# Altium schematic sheet Main_Power.SchDoc
size A1; Organization: Protel International P/L; Address1: L3, 12a Rodborough Rd; Address2: Frenchs Forest; Address3: NSW; Address4: Australia 2086
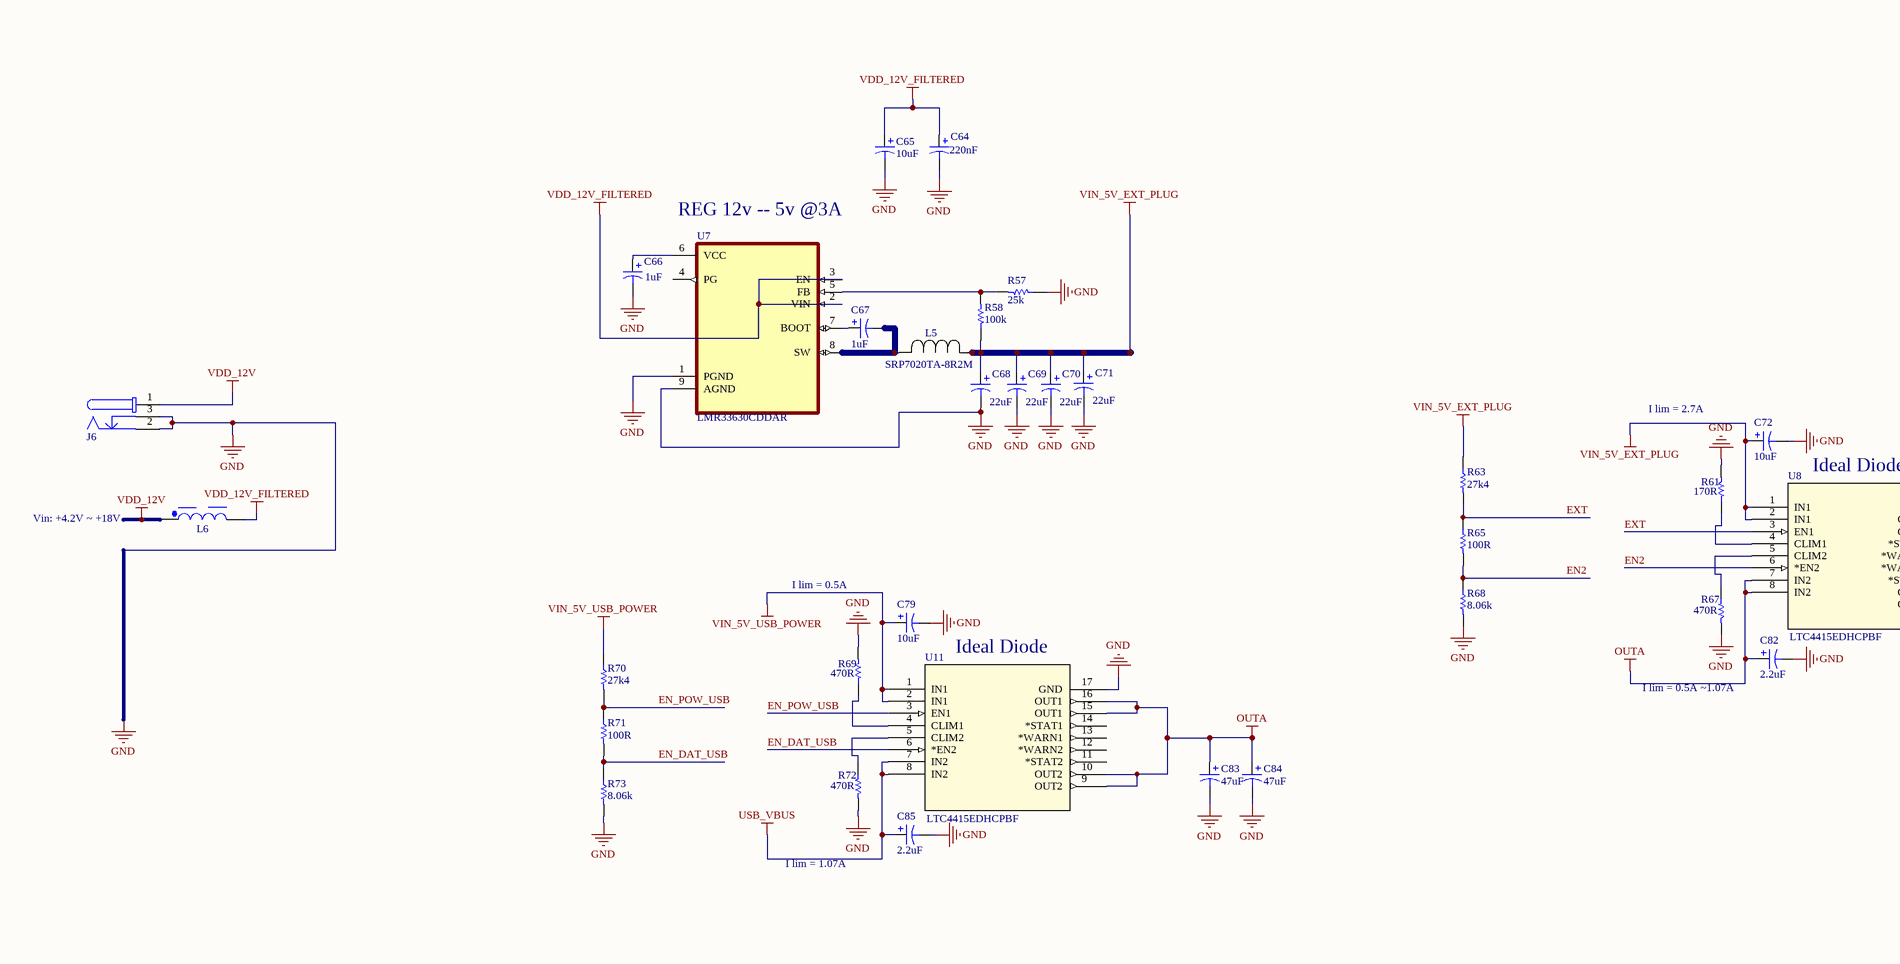
[diagram p0: Main_Power.SchDoc, top left]
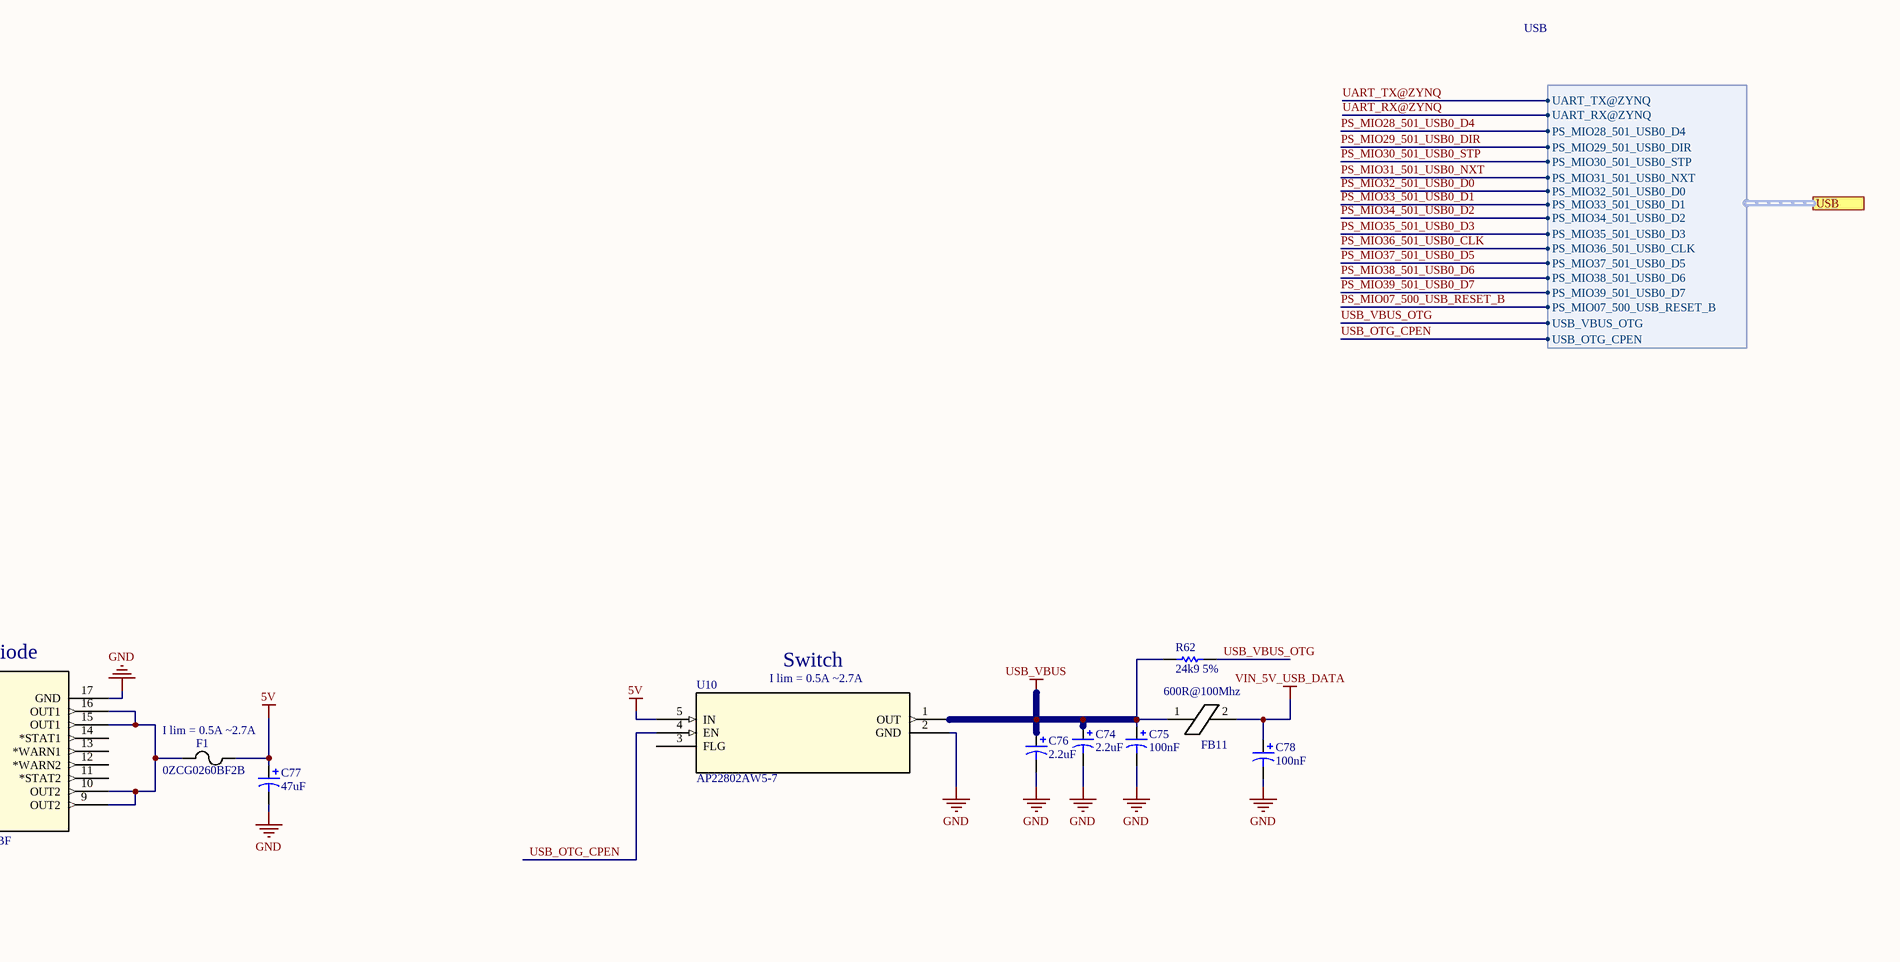
[diagram p1: Main_Power.SchDoc, top right]
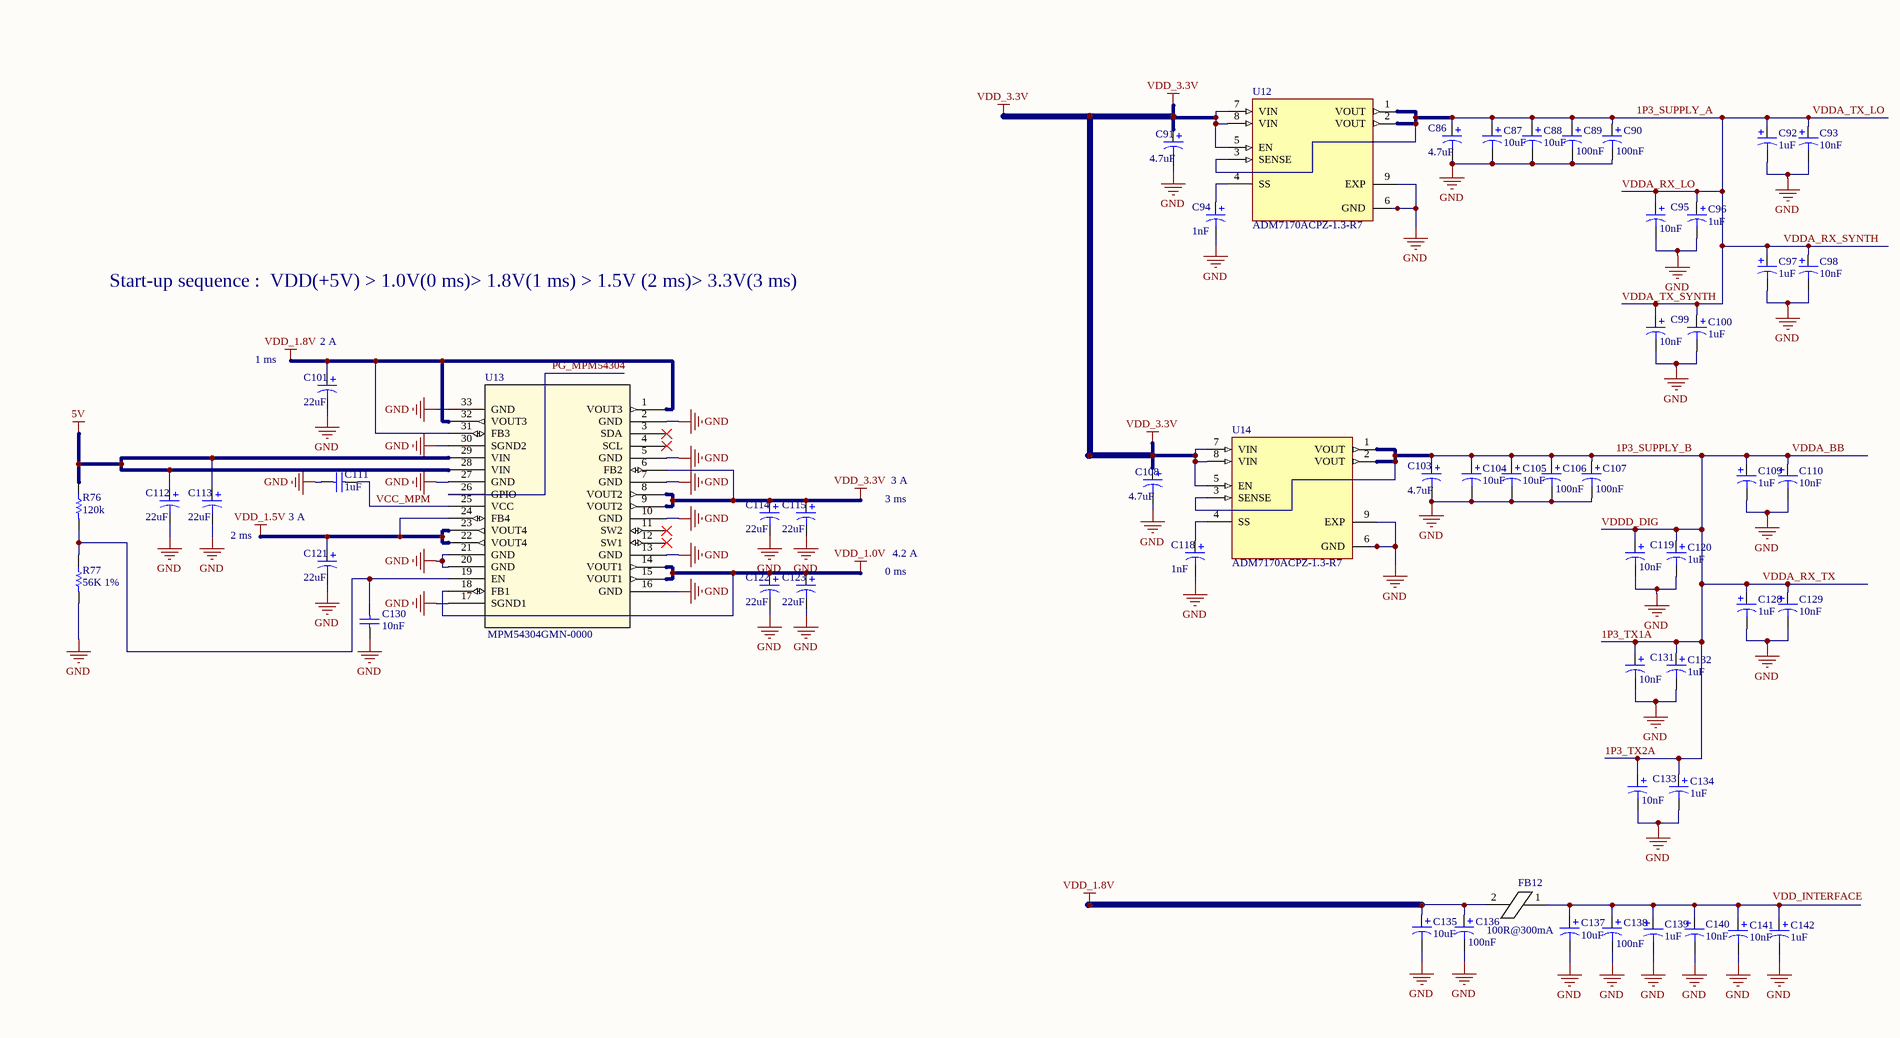
[diagram p2: Main_Power.SchDoc, bottom left]
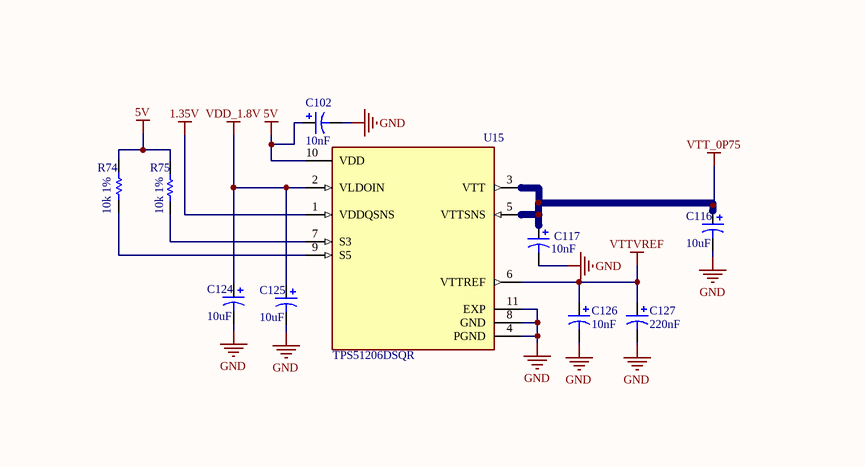
[diagram p3: Main_Power.SchDoc, bottom right]

## Parts
C64  value 220nF  [C0805]  (hidden comment: Pol3)
C65  value 10uF  [C0805]  (hidden comment: Cap Pol3)
C66  value 1uF  [C0805]  (hidden comment: Pol3)
C67  value 1uF  [C0805]  (hidden comment: Pol3)
C68  value 22uF  [C0805]  (hidden comment: Pol3)
C69  value 22uF  [C0805]  (hidden comment: Pol3)
C70  value 22uF  [C0805]  (hidden comment: Pol3)
C71  value 22uF  [C0805]  (hidden comment: Pol3)
C72  value 10uF  [C0805]  (hidden comment: Cap Pol3)
C74  value 2.2uF  [C0805]  (hidden comment: Cap Pol3)
C75  value 100nF  [C0805]  (hidden comment: Cap Pol3)
C76  value 2.2uF  [C0805]  (hidden comment: Cap Pol3)
C77  value 47uF  [C0805]  (hidden comment: Cap Pol3)
C78  value 100nF  [C0805]  (hidden comment: Cap Pol3)
C79  value 10uF  [C0805]  (hidden comment: Cap Pol3)
C82  value 2.2uF  [C0805]  (hidden comment: Cap Pol3)
C83  value 47uF  [C0805]  (hidden comment: Cap Pol3)
C84  value 47uF  [C0805]  (hidden comment: Cap Pol3)
C85  value 2.2uF  [C0805]  (hidden comment: Cap Pol3)
C86  value 4.7uF  [C0805]  (hidden comment: Pol3)
C87  value 10uF  [C0805]  (hidden comment: Cap Pol3)
C88  value 10uF  [C0805]  (hidden comment: Cap Pol3)
C89  value 100nF  [C0805]  (hidden comment: Cap Pol3)
C90  value 100nF  [C0805]  (hidden comment: Cap Pol3)
C91  value 4.7uF  [C0805]  (hidden comment: Pol3)
C92  value 1uF  [C0805]  (hidden comment: Cap Pol3)
C93  value 10nF  [C0805]  (hidden comment: Cap Pol3)
C94  value 1nF  [C0805]  (hidden comment: Pol3)
C95  value 10nF  [C0805]  (hidden comment: Cap Pol3)
C96  value 1uF  [C0805]  (hidden comment: Cap Pol3)
C97  value 1uF  [C0805]  (hidden comment: Cap Pol3)
C98  value 10nF  [C0805]  (hidden comment: Cap Pol3)
C99  value 10nF  [C0805]  (hidden comment: Cap Pol3)
C100  value 1uF  [C0805]  (hidden comment: Cap Pol3)
C101  value 22uF  [C0805]  (hidden comment: Pol3)
C102  value 10nF  [C0805]  (hidden comment: Cap Pol3)
C103  value 4.7uF  [C0805]  (hidden comment: Pol3)
C104  value 10uF  [C0805]  (hidden comment: Cap Pol3)
C105  value 10uF  [C0805]  (hidden comment: Cap Pol3)
C106  value 100nF  [C0805]  (hidden comment: Cap Pol3)
C107  value 100nF  [C0805]  (hidden comment: Cap Pol3)
C108  value 4.7uF  [C0805]  (hidden comment: Pol3)
C109  value 1uF  [C0805]  (hidden comment: Cap Pol3)
C110  value 10nF  [C0805]  (hidden comment: Cap Pol3)
C111  value 1uF  [1608[0603]]
C112  value 22uF  [C0805]  (hidden comment: Pol3)
C113  value 22uF  [C0805]  (hidden comment: Pol3)
C114  value 22uF  [C0805]  (hidden comment: Pol3)
C115  value 22uF  [C0805]  (hidden comment: Pol3)
C116  value 10uF  [C0805]  (hidden comment: Pol3)
C117  value 10nF  [C0805]  (hidden comment: Cap Pol3)
C118  value 1nF  [C0805]  (hidden comment: Pol3)
C119  value 10nF  [C0805]  (hidden comment: Cap Pol3)
C120  value 1uF  [C0805]  (hidden comment: Cap Pol3)
C121  value 22uF  [C0805]  (hidden comment: Pol3)
C122  value 22uF  [C0805]  (hidden comment: Pol3)
C123  value 22uF  [C0805]  (hidden comment: Pol3)
C124  value 10uF  [C0805]  (hidden comment: Pol3)
C125  value 10uF  [C0805]  (hidden comment: Pol3)
C126  value 10nF  [C0805]  (hidden comment: Cap Pol3)
C127  value 220nF  [C0805]  (hidden comment: Cap Pol3)
C128  value 1uF  [C0805]  (hidden comment: Cap Pol3)
C129  value 10nF  [C0805]  (hidden comment: Cap Pol3)
C130  value 10nF  [1608[0603]]
C131  value 10nF  [C0805]  (hidden comment: Cap Pol3)
C132  value 1uF  [C0805]  (hidden comment: Cap Pol3)
C133  value 10nF  [C0805]  (hidden comment: Cap Pol3)
C134  value 1uF  [C0805]  (hidden comment: Cap Pol3)
C135  value 10uF  [C0805]  (hidden comment: Cap Pol3)
C136  value 100nF  [C0805]  (hidden comment: Cap Pol3)
C137  value 10uF  [C0805]  (hidden comment: Cap Pol3)
C138  value 100nF  [C0805]  (hidden comment: Cap Pol3)
C139  value 1uF  [C0805]  (hidden comment: Cap Pol3)
C140  value 10nF  [C0805]  (hidden comment: Cap Pol3)
C141  value 10nF  [C0805]  (hidden comment: Cap Pol3)
C142  value 1uF  [C0805]  (hidden comment: Cap Pol3)
F1  0ZCG0260BF2B  [0ZCG_BEL]
FB11  FERRITA  [0805R]  (value not drawn)
FB12  FERRITA  [0805R]  (value not drawn)
J6  694108301002  [694108301002]  (value not drawn)
L5  SRP7020TA-8R2M  [IND_SRP7020TA-8R2M_BRN]
L6  4.7uH, 2.9A  [WE-PD_7332R]  (value not drawn)
R57  value 25k  [0603]  (hidden comment: Res1)
R58  value 100k  [0603]  (hidden comment: Res1)
R61  value 170R  [0603]  (hidden comment: Res1)
R62  value 24k9 5%  [0603]  (hidden comment: Res1)
R63  value 27k4  [0603]  (hidden comment: Res1)
R65  value 100R  [0603]  (hidden comment: Res1)
R67  value 470R  [0603]  (hidden comment: Res1)
R68  value 8.06k  [0603]  (hidden comment: Res1)
R69  value 470R  [0603]  (hidden comment: Res1)
R70  value 27k4  [0603]  (hidden comment: Res1)
R71  value 100R  [0603]  (hidden comment: Res1)
R72  value 470R  [0603]  (hidden comment: Res1)
R73  value 8.06k  [0603]  (hidden comment: Res1)
R74  value 10k 1%  [0603]  (hidden comment: Res1)
R75  value 10k 1%  [0603]  (hidden comment: Res1)
R76  value 120k  [0603]  (hidden comment: Res1)
R77  value 56K 1%  [0603]  (hidden comment: Res1)
U7  LMR33630CDDAR  [VREG_LM5017MR/NOPB]
U8  LTC4415EDHCPBF  [05-08-1872_ADI]
U10  AP22802AW5-7  [SOT25_DIO]
U11  LTC4415EDHCPBF  [05-08-1872_ADI]
U12  ADM7170ACPZ-1.3-R7  [SON50P300X300X80-9N]
U13  MPM54304GMN-0000  [LGA7x7x2_MNP]
U14  ADM7170ACPZ-1.3-R7  [SON50P300X300X80-9N]
U15  TPS51206DSQR  [SON40P200X200X80-11N]

## Ports
USB (harness USB)

## Harnesses
USB: PS_MIO29_501_USB0_DIR, PS_MIO28_501_USB0_D4, PS_MIO30_501_USB0_STP, PS_MIO31_501_USB0_NXT, PS_MIO33_501_USB0_D1, PS_MIO32_501_USB0_D0, PS_MIO34_501_USB0_D2, PS_MIO35_501_USB0_D3, PS_MIO37_501_USB0_D5, PS_MIO36_501_USB0_CLK, PS_MIO38_501_USB0_D6, PS_MIO39_501_USB0_D7, PS_MIO07_500_USB_RESET_B, USB_VBUS_OTG, USB_OTG_CPEN, UART_RX@ZYNQ, UART_TX@ZYNQ

## Nets
1.35V: U15.1(VDDQSNS)
5V: C77.1 C102.1 C112.1 C113.1 F1.2 R74.2 R75.2 R76.1 U10.5(IN) U13.28(VIN) U13.29(VIN) U15.10(VDD)
GND: C64.2 C65.2 C66.2 C68.2 C69.2 C70.2 C71.2 C72.2 C74.2 C75.2 C76.2 C77.2 C78.2 C79.2 C82.2 C83.2 C84.2 C85.2 C86.2 C87.2 C88.2 C89.2 C90.2 C91.2 C92.2 C93.2 C94.2 C95.2 C96.2 C97.2 C98.2 C99.2 C100.2 C101.2 C102.2 C103.2 C104.2 C105.2 C106.2 C107.2 C108.2 C109.2 C110.2 C111.2 C112.2 C113.2 C114.2 C115.2 C116.2 C117.2 C118.2 C119.2 C120.2 C121.2 C122.2 C123.2 C124.2 C125.2 C126.2 C127.2 C128.2 C129.2 C130.2 C131.2 C132.2 C133.2 C134.2 C135.2 C136.2 C137.2 C138.2 C139.2 C140.2 C141.2 C142.2 J6.2 J6.3 R57.1 R61.2 R67.2 R68.2 R69.2 R72.2 R73.2 R77.2 U7.1(PGND) U7.9(AGND) U8.17(GND) U10.2(GND) U11.17(GND) U12.6(GND) U12.9(EXP) U13.2(GND) U13.5(GND) U13.7(GND) U13.10(GND) U13.13(GND) U13.16(GND) U13.17(SGND1) U13.20(GND) U13.21(GND) U13.27(GND) U13.30(SGND2) U13.33(GND) U14.6(GND) U14.9(EXP) U15.4(PGND) U15.8(GND) U15.11(EXP)
OUTA: C82.1 C83.1 C84.1 U8.7(IN2) U8.8(IN2) U11.9(OUT2) U11.10(OUT2) U11.15(OUT1) U11.16(OUT1)
USB_VBUS: C74.1 C75.1 C76.1 C85.1 FB11.1 R62.2 U10.1(OUT) U11.7(IN2) U11.8(IN2)
VDD_1.0V: C122.1 C123.1 U13.14(VOUT1) U13.15(VOUT1) U13.18(FB1)
VDD_1.5V: C121.1 U13.22(VOUT4) U13.23(VOUT4) U13.24(FB4)
VDD_1.8V: C101.1 C124.1 C125.1 C135.1 C136.1 FB12.2 U13.1(VOUT3) U13.31(FB3) U13.32(VOUT3) U15.2(VLDOIN)
VDD_3.3V: C91.1 C108.1 C114.1 C115.1 U12.5(EN) U12.7(VIN) U12.8(VIN) U13.6(FB2) U13.8(VOUT2) U13.9(VOUT2) U14.5(EN) U14.7(VIN) U14.8(VIN)
VDD_12V: J6.1 L6.1
VDD_12V_FILTERED: C64.1 C65.1 L6.2 U7.2(VIN) U7.3(EN)
VIN_5V_EXT_PLUG: C68.1 C69.1 C70.1 C71.1 C72.1 L5.1 R58.1 R63.1 U8.1(IN1) U8.2(IN1)
VIN_5V_USB_DATA: C78.1 FB11.2
VIN_5V_USB_POWER: C79.1 R70.1 U11.1(IN1) U11.2(IN1)
VTT_0P75: C116.1 C117.1 U15.3(VTT) U15.5(VTTSNS)
VTTVREF: C126.1 C127.1 U15.6(VTTREF)
1P3_SUPPLY_A: C86.1 C87.1 C88.1 C89.1 C90.1 C92.1 C93.1 C95.1 C96.1 C97.1 C98.1 C99.1 C100.1 U12.1(VOUT) U12.2(VOUT) U12.3(SENSE)  [also labelled VDDA_RX_LO, VDDA_RX_SYNTH, VDDA_TX_LO, VDDA_TX_SYNTH]
1P3_SUPPLY_B: C103.1 C104.1 C105.1 C106.1 C107.1 C109.1 C110.1 C119.1 C120.1 C128.1 C129.1 C131.1 C132.1 C133.1 C134.1 U14.1(VOUT) U14.2(VOUT) U14.3(SENSE)  [also labelled 1P3_TX1A, 1P3_TX2A, VDDA_BB, VDDA_RX_TX, VDDD_DIG]
EN2: R65.2 R68.1 U8.6(*EN2)
EN_DAT_USB: R71.2 R73.1 U11.6(*EN2)
EN_POW_USB: R70.2 R71.1 U11.3(EN1)
EXT: R63.2 R65.1 U8.3(EN1)
PG_MPM54304: U13.26(GPIO)
PS_MIO07_500_USB_RESET_B: port USB.PS_MIO07_500_USB_RESET_B
PS_MIO28_501_USB0_D4: port USB.PS_MIO28_501_USB0_D4
PS_MIO29_501_USB0_DIR: port USB.PS_MIO29_501_USB0_DIR
PS_MIO30_501_USB0_STP: port USB.PS_MIO30_501_USB0_STP
PS_MIO31_501_USB0_NXT: port USB.PS_MIO31_501_USB0_NXT
PS_MIO32_501_USB0_D0: port USB.PS_MIO32_501_USB0_D0
PS_MIO33_501_USB0_D1: port USB.PS_MIO33_501_USB0_D1
PS_MIO34_501_USB0_D2: port USB.PS_MIO34_501_USB0_D2
PS_MIO35_501_USB0_D3: port USB.PS_MIO35_501_USB0_D3
PS_MIO36_501_USB0_CLK: port USB.PS_MIO36_501_USB0_CLK
PS_MIO37_501_USB0_D5: port USB.PS_MIO37_501_USB0_D5
PS_MIO38_501_USB0_D6: port USB.PS_MIO38_501_USB0_D6
PS_MIO39_501_USB0_D7: port USB.PS_MIO39_501_USB0_D7
UART_RX@ZYNQ: port USB.UART_RX@ZYNQ
UART_TX@ZYNQ: port USB.UART_TX@ZYNQ
USB_OTG_CPEN: U10.4(EN) ; port USB.USB_OTG_CPEN
USB_VBUS_OTG: R62.1 ; port USB.USB_VBUS_OTG
VCC_MPM: C111.1 U13.25(VCC)
NetC66_1: C66.1 U7.6(VCC)
NetC67_1: C67.1 U7.7(BOOT)
NetC67_2: C67.2 L5.2 U7.8(SW)
NetC94_1: C94.1 U12.4(SS)
NetC118_1: C118.1 U14.4(SS)
NetC130_1: C130.1 R76.2 R77.1 U13.19(EN)
NetC137_1: C137.1 C138.1 C139.1 C140.1 C141.1 C142.1 FB12.1
NetF1_1: F1.1 U8.9(OUT2) U8.10(OUT2) U8.15(OUT1) U8.16(OUT1)
NetR57_2: R57.2 R58.2 U7.5(FB)
NetR61_1: R61.1 U8.4(CLIM1)
NetR67_1: R67.1 U8.5(CLIM2)
NetR69_1: R69.1 U11.4(CLIM1)
NetR72_1: R72.1 U11.5(CLIM2)
NetR74_1: R74.1 U15.9(S5)
NetR75_1: R75.1 U15.7(S3)

Not connected (* = marked no-connect by the designer): U7 4(PG); U8 11(*STAT2) 12(*WARN2) 13(*WARN1) 14(*STAT1); U10 3(FLG); U11 11(*STAT2) 12(*WARN2) 13(*WARN1) 14(*STAT1); U13 3(SDA)* 4(SCL)* 11(SW2)* 12(SW1)*

## Notes on the sheet
- (near U7) REG 12v -- 5v @3A
- I lim = 2.7A
- Ideal Diode
- (near U10) Switch
- Vin: +4.2V ~ +18V
- (near F1) I lim = 0.5A ~2.7A
- (near U10) I lim = 0.5A ~2.7A
- 600R@100Mhz
- I lim = 0.5A
- (near C82) I lim = 0.5A ~1.07A
- I lim = 1.07A
- Start-up sequence :  VDD(+5V) > 1.0V(0 ms)> 1.8V(1 ms) > 1.5V (2 ms)> 3.3V(3 ms)
- 1 ms
- (near C101) 2 A
- 3 A
- (near C113) 2 ms
- 3 ms
- 0 ms
- 4.2 A
- 100R@300mA
- Labels drawn without touching a wire or pin: VDD_INTERFACE
- Title
- Size:
- Date:
- File:
- A1
- Number:
- Time:
- Revision:
- Sheet
- of

## Library data of the parts
C64-C72 C74-C79 C82-C110 C112-C129 C131-C142 = Cap Pol3: Polarized Capacitor (Surface Mount); Published: 8-Jun-2000; LatestRevisionDate: 29-May-2009; LatestRevisionNote: IPC-7351 Footprint Added.; PackageReference: C0805; Publisher: Altium Limited; PackageDescription: Chip Capacitor
C111 C130 = Cap Semi: Capacitor (Semiconductor SIM Model); Published: 8-Jun-2000; LatestRevisionDate: 29-May-2009; LatestRevisionNote: IPC-7351 Footprint Added.; PackageReference: C1206; Publisher: Altium Limited; PackageDescription: Chip Capacitor
F1 = 0ZCG0260BF2B: No Description Available; Mfr_Name: Belfuse
J6 = 694108301002: WR-DC DC Power Jack Connector, Male, Right Angled, 24V, 5A; Manufacturer: Wurth Elektronik; Opening Diameter: 6.4mm; Plug Inner Diameter: 2.55mm; Plug Outer Diameter: 5.5mm; ComponentLink1Description: Website Link; ComponentLink1URL: https://www.we-online.com/redexpert/article/694108301002?ad; ComponentLink2Description: Datasheet Link; ComponentLink2URL: https://www.we-online.com/redexpert/spec/694108301002?ad; Manufacturer Part Number: 694108301002; Category: DC Power Jack Connector; Match Code: WR-DC; Mount: Through Hole; Operating Temperature Max: 85°C; Operating Temperature Min: -40°C; Packaging: Bag; Gender: Male; Orientation: Right Angled; Rated Current: 5A; Working Voltage: 24V
L5 = SRP7020TA-8R2M: No Description Available; Mfr_Name: Bourns Electronics
L6 = 7447789004: WE-PD SMT Power Inductor, size 7332R, 4.7uH, 2.9A, 39mOhm; Manufacturer: Wurth Elektronik; DC Resistance: 33mOhm; Saturation Current: 3.9A; Self Resonant Frequency: 45MHz; Type: Robust; Manufacturer Part Number: 7447789004; Category: Power Inductors; Match Code: WE-PD; ComponentLink1Description: Website Link; ComponentLink1URL: https://www.we-online.com/redexpert/article/7447789004?ad; ComponentLink2Description: Datasheet Link; ComponentLink2URL: https://www.we-online.com/redexpert/spec/7447789004?ad; Mount: Surface Mount; Operating Temperature Max: 125°C; Operating Temperature Min: -40°C; Packaging: Tape and Reel; Case/Size Code: 7332R; Length: 7.3mm; Width: 7.3mm; Height: 3.2mm; DC Resistance Max: 39mOhm; Inductance: 4.7uH; Rated Current: 2.9A
R57 R58 R61-R63 R65 R67-R77 = Res1_1: Resistor; Manufacturer: Generic Components; Class I: Passive; Published: 8-Jun-2000; Revision: July-2002: Re-released for DXP Platform.; Publisher: Altium Limited; Class II: Resistor; REF FARNELL 1206 SMD 510R: 4387065; REF FARNELL 1206 SMD 1K: 912475; REF FARNELL 1206 SMD 10K: 912591; REF FARNELL 0603 SMD: 612-595
U7 = LMR33630CDDAR: SIMPLE SWITCHER 3.8V to 36V, 3A Synchronous Buck Converter With Ultra-Low EMI 8-SO PowerPAD -40 to 125; MF: Texas Instruments; MP: LMR33630CDDAR; Package: HSOIC-8 Texas Instruments; Purchase-URL: https://pricing.snapeda.com/search/part/LMR33630CDDAR/?ref=eda; Check_prices: https://www.snapeda.com/parts/LMR33630CDDAR/Texas%20Instruments/view-part/2725482/?ref=eda; SnapEDA_Link: https://www.snapeda.com/parts/LMR33630CDDAR/Texas%20Instruments/view-part/2725482/?ref=snap; Price: None; Availability: Warning; Value: *
U8 U11 = LTC4415EDHCPBF: No Description Available; Mfr_Name: Analog Devices Inc; Type: Power Management; RefDes: RefDes
U10 = AP22802AW5-7: No Description Available; Mfr_Name: Diodes Inc; RefDes: RefDes; Type: Type
U12 U14 = ADM7170ACPZ-1.3-R7: 6.5 V, 500 mA, Ultralow Noise, High PSRR, Fast Transient Response CMOS LDO; MF: Analog Devices; SnapEDA_Link: https://www.snapeda.com/parts/ADM7170ACPZ-1.3-R7/Analog+Devices/view-part/?ref=snap; Package: LFCSP -8 Analog Devices; Value: *; MP: ADM7170ACPZ-1.3-R7; Check_prices: https://www.snapeda.com/parts/ADM7170ACPZ-1.3-R7/Analog+Devices/view-part/?ref=eda
U13 = MPM54304GMN-0000: No Description Available; Mfr_Name: Monolithic Power Systems; RefDes: RefDes; Type: Type
U15 = TPS51206DSQR: 2A Peak Sink/Source DDR Termination Regulator with VTTREF Buffered Reference for DDR2/3/3L/4 10-WSON -40 to 105; MF: Texas Instruments; Texas_Instruments-Purchase-URL: https://snapeda.com/shop?store=Texas+Instruments&id=449732; Value: *; Availability: Good; Price: None; MP: TPS51206DSQR; DigiKey-Purchase-URL: https://snapeda.com/shop?store=DigiKey&id=449732; Package: WSON-10 Texas Instruments; SnapEDA_Link: https://www.snapeda.com/parts/TPS51206DSQR/Texas%20Instruments/view-part/449732/?ref=snap; Mouser-Purchase-URL: https://snapeda.com/shop?store=Mouser&id=449732
FB11 FB12 = FERRITA: CODIGO DIGIKEY: *; CODIGO FARNELL: *; CODIGO MOUSER: *; CODIGO PRODUCTO: *; DISTRIBUIDOR 1: *; DISTRIBUIDOR 2: *